# Altium schematic sheet MCU.SchDoc
size A3; SheetNumber: 3; SheetTotal: 7
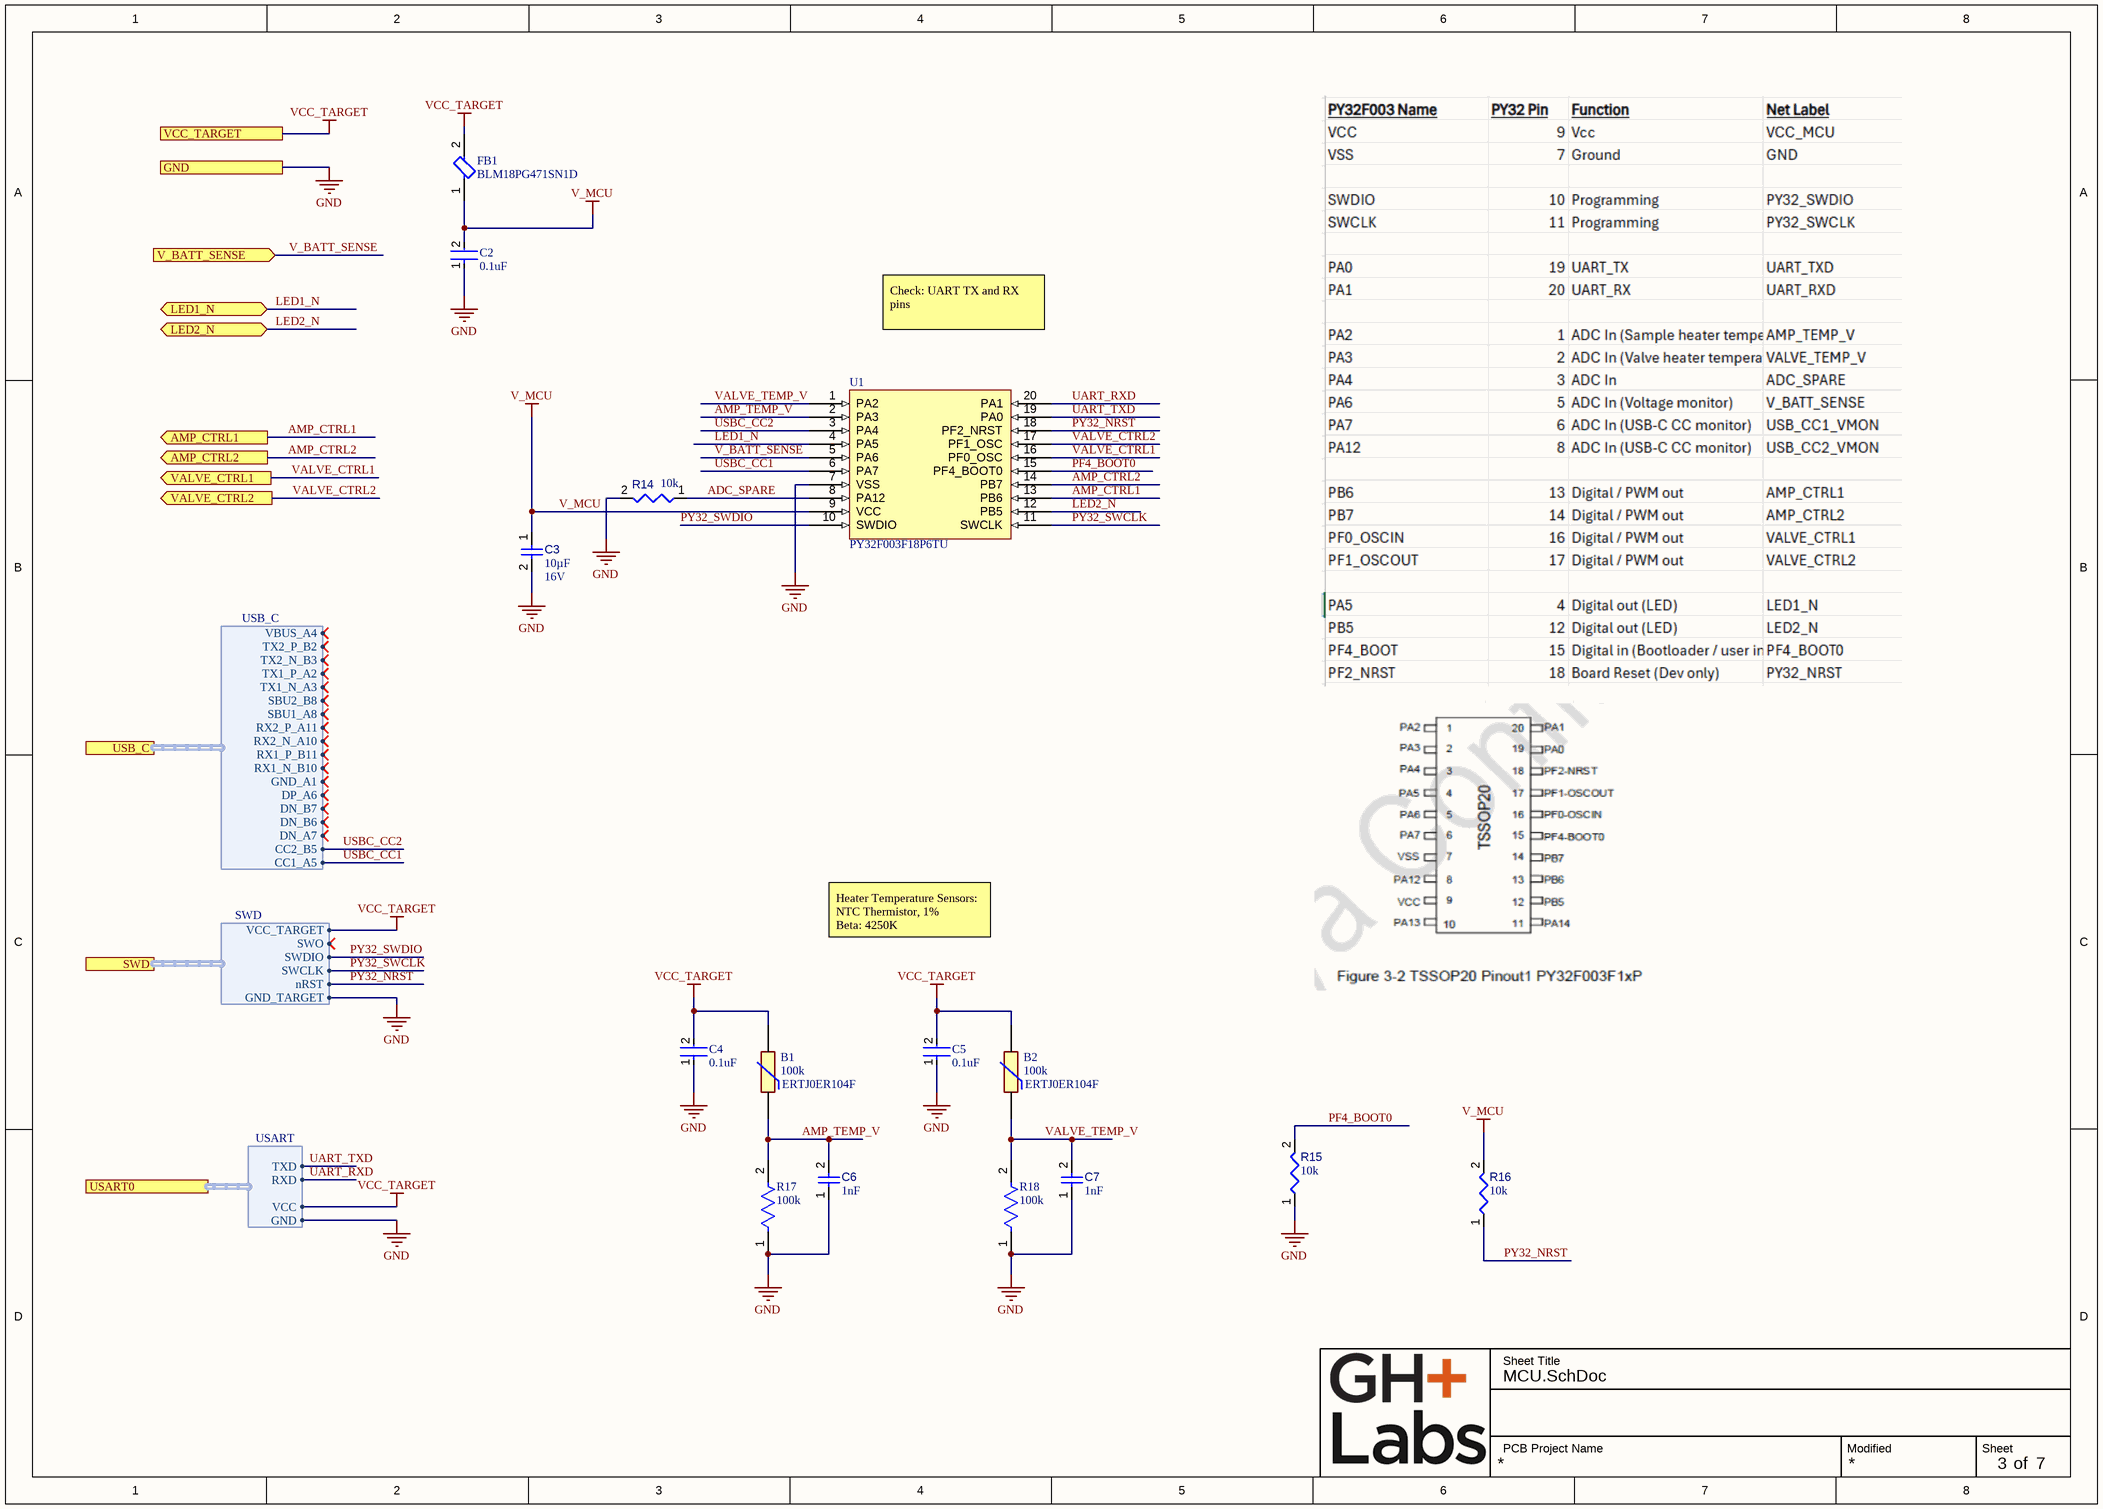
[diagram p0: MCU.SchDoc]

## Parts
B1  value 100k  [THRMC1005X55N]  (hidden comment: ERTJ0ER104F)
B2  value 100k  [THRMC1005X55N]  (hidden comment: ERTJ0ER104F)
C2  0.1uF  [FP-CL17-IPC_C]
C3  value 10µF  Voltage Rating: 16V  [CAPC1608X09N]  (hidden comment: CL10A106MO8NQNC)
C4  0.1uF  [FP-CL17-IPC_C]
C5  0.1uF  [FP-CL17-IPC_C]
C6  value 1nF  [FP-C0402C102K4RAC7411-IPC_B]  (hidden comment: C0402C102K4RAC7411)
C7  value 1nF  [FP-C0402C102K4RAC7411-IPC_B]  (hidden comment: C0402C102K4RAC7411)
FB1  BLM18PG471SN1D  [FP-BLM18-0_15-t0_8-MFG]
R14  value 10k  [RESC0402(1005)_L]  (hidden comment: Resistor 10K  +/-1 % 0402 63 mW)
R15  value 10k  [RESC0402(1005)_L]  (hidden comment: Resistor 10K  +/-1 % 0402 63 mW)
R16  value 10k  [RESC0402(1005)_L]  (hidden comment: Resistor 10K  +/-1 % 0402 63 mW)
R17  Resistance: 100k  [FP-CRCW0402-e3-IPC_C]  (hidden comment: CRCW0402100KFKED)
R18  Resistance: 100k  [FP-CRCW0402-e3-IPC_C]  (hidden comment: CRCW0402100KFKED)
U1  PY32F003F18P6TU  [SOP65P640X120-20N]

## Ports
AMP_CTRL1 (out), AMP_CTRL2 (out), GND, LED1_N (bidir), LED2_N (bidir), SWD (harness SWD), USART0 (harness USART), USB_C (harness USB_C), V_BATT_SENSE (in), VALVE_CTRL1 (out), VALVE_CTRL2 (out), VCC_TARGET

## Harnesses
USART: RXD, VCC, GND, TXD
SWD: GND_TARGET, nRST, SWCLK, SWDIO, SWO, VCC_TARGET
USB_C: CC1_A5, CC2_B5, DN_A7, DN_B6, DN_B7, DP_A6, GND_A1, RX1_N_B10, RX1_P_B11, RX2_N_A10, RX2_P_A11, SBU1_A8, SBU2_B8, TX1_N_A3, TX1_P_A2, TX2_N_B3, TX2_P_B2, VBUS_A4

## Nets
GND: C2.1 C3.2 C4.1 C5.1 C6.1 C7.1 R14.2 R15.1 R17.1 R18.1 U1.7(VSS) ; port GND, port USART0.GND, port SWD.GND_TARGET
V_MCU: C2.2 C3.1 FB1.1 R16.2 U1.9(VCC)
VCC_TARGET: B1.2 B2.2 C4.2 C5.2 FB1.2 ; port VCC_TARGET, port USART0.VCC, port SWD.VCC_TARGET
ADC_SPARE: R14.1 U1.8(PA12)
AMP_CTRL1: U1.13(PB6) ; port AMP_CTRL1
AMP_CTRL2: U1.14(PB7) ; port AMP_CTRL2
AMP_TEMP_V: B1.1 C6.2 R17.2 U1.2(PA3)
LED1_N: U1.4(PA5) ; port LED1_N
LED2_N: U1.12(PB5) ; port LED2_N
PF4_BOOT0: R15.2 U1.15(PF4_BOOT0)
PY32_NRST: R16.1 U1.18(PF2_NRST) ; port SWD.nRST
PY32_SWCLK: U1.11(SWCLK) ; port SWD.SWCLK
PY32_SWDIO: U1.10(SWDIO) ; port SWD.SWDIO
UART_RXD: U1.20(PA1) ; port USART0.RXD
UART_TXD: U1.19(PA0) ; port USART0.TXD
USBC_CC1: U1.6(PA7) ; port USB_C.CC1_A5
USBC_CC2: U1.3(PA4) ; port USB_C.CC2_B5
V_BATT_SENSE: U1.5(PA6) ; port V_BATT_SENSE
VALVE_CTRL1: U1.16(PF0_OSC) ; port VALVE_CTRL1
VALVE_CTRL2: U1.17(PF1_OSC) ; port VALVE_CTRL2
VALVE_TEMP_V: B2.1 C7.2 R18.2 U1.1(PA2)

## Notes on the sheet
- Check: UART TX and RX pins
- Heater Temperature Sensors:
  NTC Thermistor, 1%
  Beta: 4250K
- Sheet Title
- PCB Project Name
- Modified
- Sheet
- of

## Library data of the parts
B1 B2 = CMP-009-00178-1: Thermistor, NTC, 100k, 1%,  4250k, 0402; Manufacturer 1: Panasonic; Manufacturer Lifecycle 1: Unknown; Power: 66mW; Geometry.Height: 0.55mm; Min Operating Temperature: -40°C; Design Item ID: ERTJ0ER104F; Supplier Part Number 1: C236279; Mouser Part Number: 667-ERT-J0ER104FM; Datasheet Link: https://industrial.panasonic.com/cdbs/www-data/pdf/AUA0000/AUA0000C8.pdf; Max Operating Temperature: 125°C; Manufacturer_Name: Panasonic; Tolerance: 1%; Supplier Unit Price 1: .0262; Manufacturer Part Number 1: ERTJ0ER104F; Supplier 1: LCSC; Manufacturer_Part_Number: ERTJ0ER104F; RoHS Compliant: Yes; Pins: 2; Mounting Technology: Surface Mount; Mouser Price/Stock: https://www.mouser.com/ProductDetail/Panasonic/ERT-J0ER104FM
C2 C4 C5 = CMP-13271-001069-1: Cap Ceramic 100nF 10V X7R ±10% SMD 0402 +125°C Paper T/R; Height: 0.5mm; Case/Package: 0402; Contact Plating: Tin; Case Code (Imperial): 0402; Capacitance: 100nF; Thickness: 0.022inch; Min Operating Temperature: -55°C; Package Quantity: 1; Length: 1mm; Max Operating Temperature: 125°C; Depth: 0.5mm; Voltage Rating: 10V; Packaging: Tape and Reel; Mount: Surface Mount; Tolerance: 10%; Width: 0.02inch; Radiation Hardening: No; Case Code (Metric): 1005; Dielectric: X7R
C3 = CMP-001-00088-2: Ceramic Capacitor, Multilayer, Ceramic, 16V, 20% +Tol, 20% -Tol, X5R, 15% TC, 10uF, Surface Mount, 0603; Manufacturer 1: Samsung; Manufacturer Lifecycle 1: Unknown; RoHS Compliant: Yes; Min Operating Temperature: -55°C; Manufacturer Part Number 1: CL10A106MO8NQNC; Case/Package: 0603; Supplier 1: LCSC; Supplier Unit Price 1: .007; Capacitor Type: Ceramic; Supplier Part Number 1: C92487; Max Operating Temperature: 85°C; Pins: 2; Mounting Technology: Surface Mount
C6 C7 = CMP-001-00087-1: Ceramic Capacitor, Multilayer, Ceramic, 16V, 10% +Tol, 10% -Tol, X7R, 15% TC, 0.001uF, Surface Mount, 0402; Min Operating Temperature: -55°C; RoHS Compliant: Yes; Max Operating Temperature: 125°C; Case/Package: 0402; Pins: 2; Capacitor Type: Ceramic
FB1 = CMP-0686-00587-3: Chip Ferrite Bead, 0603, 470Ω @ 100MHz, 0.2Ω, 25%, 1A; DC Resistance (DCR): 200mR; Number of Circuits: 1; Material: Steel; Impedance: 470R; Core Material: Ferrite; Width: 0.8mm; Termination: SMD/SMT; Series: BLM18P; Min Operating Temperature: -55°C; DC Resistance-Max: 200mR; Current Rating: 1A; Package Quantity: 1; Max Operating Temperature: 125°C; Military Standard: Not; REACH SVHC: No SVHC; Max Current Rating: 1A; Number of Pins: 2; RoHS Compliant: Yes; Tolerance: 25%; Packaging: Tape and Reel; Number of Lines: 1; Resistance: 200mR; Length: 1.6mm; Case Code (Metric): 1608; Depth: 0.8mm; Lead Free: Lead Free; Case/Package: 0603; Height: 0.8mm; Radiation Hardening: No; Test Frequency: 100MHz; Case Code (Imperial): 0603; Max DC Current: 1A; DC Current: 1A
R14-R16 = CMP-009-00149-2: Chip Resistor, 10 kOhms, +/-1 %, 63 mW, -55 to 125 degC, 0402; Power: 63mW; Tolerance: 1%; Pins: 2; Max Operating Temperature: 155°C; Min Operating Temperature: -55°C; Case/Package: 0402
R17 R18 = CMP-2002-08123-3: RES Thick Film, 100kΩ, 1%, 0.063W, 100ppm/°C, 0402; Power Rating: 63mW; Voltage Rating (DC): 50V; Lead Free: Lead Free; Height: 0.35mm; Contact Plating: Tin; Min Operating Temperature: -55°C; Package Quantity: 10000; Case/Package: 0402; Temperature Coefficient: 100ppm/°C; Number of Terminations: 2; Packaging: Tape and Reel; Max Power Dissipation: 63mW; Case Code (Metric): 1005; Mount: Surface Mount; Width: 0.02inch; Termination: SMD/SMT; Length: 1mm; Number of Pins: 2; Weight: 2.3E-05oz; Radiation Hardening: No; Tolerance: 1%; Military Standard: Not; Features: Automotive AEC-Q200; Depth: 0.5mm; Composition: Thick Film; Max Operating Temperature: 155°C; Voltage Rating: 50V; Case Code (Imperial): 0402
U1 = CMP-020-00023-5: IC, MCU, ARM Cortex M0+, TSSOP-20, PY32F003F18P6TU; Manufacturer Lifecycle 1: Unknown; Manufacturer 1: Puya Semiconductor; Max Supply Voltage: 5.5V; Min Supply Voltage: 1.7V; Case/Package: TSSOP-20; Min Operating Temperature: -40°C; Pins: 20; ComponentLink2Description: https://github.com/decaday/PY32_Docs/tree/main/PY32F030_003_002A/Datasheet/PY32F003; Max Operating Temperature: 85°C; Supplier 1: LCSC; Supplier Unit Price 1: .155; Supplier Part Number 1: C5379864; Manufacturer Part Number 1: PY32F003F18P6TU